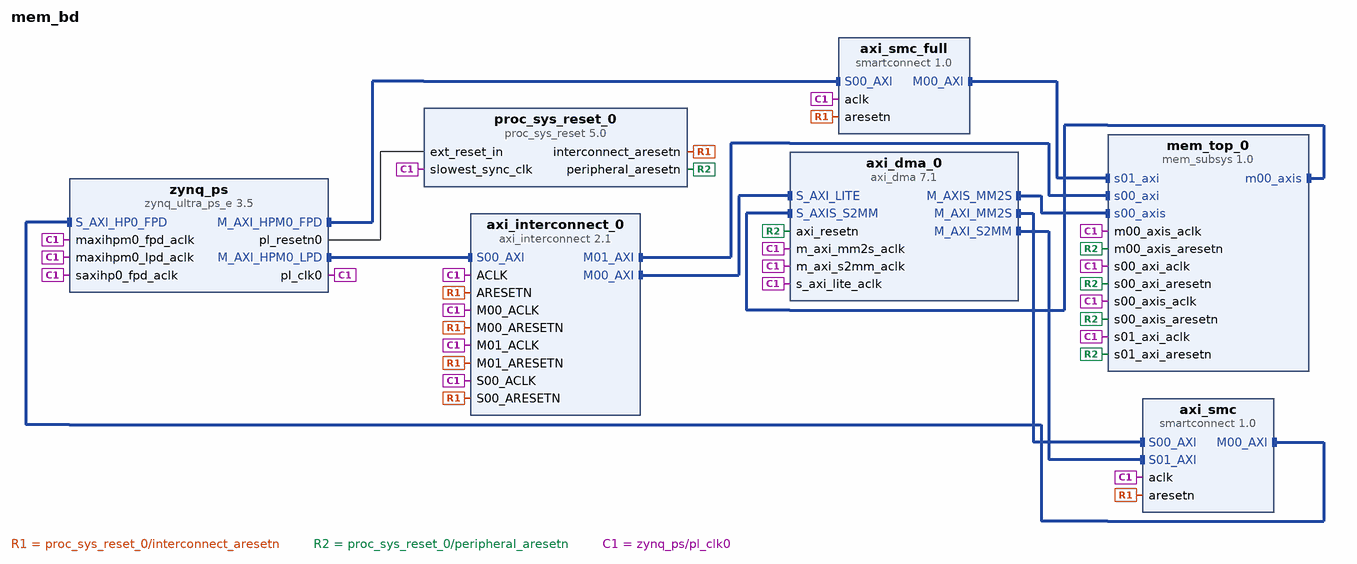
[diagram p0: block diagram of the top level]
# Vivado block design mem_bd, xczu3eg-sbva484-1-i, Vivado 2023.2
create_bd_design mem_bd

create_bd_cell -type ip -vlnv xilinx.com:ip:zynq_ultra_ps_e:3.5 zynq_ps
set_property -dict [list \
  CONFIG.PSU__CRL_APB__PL0_REF_CTRL__FREQMHZ 50 \
  CONFIG.PSU__DDR_HIGH_ADDRESS_GUI_ENABLE 0 \
  CONFIG.PSU__FPGA_PL0_ENABLE 1 \
  CONFIG.PSU__MAXIGP0__DATA_WIDTH 128 \
  CONFIG.PSU__USE__M_AXI_GP0 1 \
  CONFIG.PSU__USE__M_AXI_GP1 0 \
  CONFIG.PSU__USE__M_AXI_GP2 1 \
  CONFIG.PSU__USE__S_AXI_GP2 1 \
] [get_bd_cells zynq_ps]
# 34 more settings of zynq_ps are not shown: defaults, MIO pin electricals, DDR timing, and values the tool derives
create_bd_cell -type ip -vlnv xilinx.com:ip:proc_sys_reset:5.0 proc_sys_reset_0
create_bd_cell -type ip -vlnv xilinx.com:ip:axi_dma:7.1 axi_dma_0
set_property -dict [list \
  CONFIG.c_include_mm2s 1 \
  CONFIG.c_include_s2mm 1 \
  CONFIG.c_include_sg 0 \
  CONFIG.c_m_axi_mm2s_data_width 256 \
  CONFIG.c_m_axi_s2mm_data_width 256 \
  CONFIG.c_m_axis_mm2s_tdata_width 256 \
  CONFIG.c_mm2s_burst_size 16 \
  CONFIG.c_s2mm_burst_size 16 \
  CONFIG.c_s_axis_s2mm_tdata_width 256 \
] [get_bd_cells axi_dma_0]
create_bd_cell -type ip -vlnv user.org:user:mem_subsys:1.0 mem_top_0
create_bd_cell -type ip -vlnv xilinx.com:ip:axi_interconnect:2.1 axi_interconnect_0
set_property -dict {CONFIG.NUM_MI 2 CONFIG.NUM_SI 1} [get_bd_cells axi_interconnect_0]
create_bd_cell -type ip -vlnv xilinx.com:ip:smartconnect:1.0 axi_smc
set_property -dict {CONFIG.NUM_MI 1 CONFIG.NUM_SI 2} [get_bd_cells axi_smc]
create_bd_cell -type ip -vlnv xilinx.com:ip:smartconnect:1.0 axi_smc_full
set_property -dict {CONFIG.NUM_MI 1 CONFIG.NUM_SI 1} [get_bd_cells axi_smc_full]

# ---- connections ----

connect_bd_intf_net [get_bd_intf_pins axi_dma_0/M_AXIS_MM2S] [get_bd_intf_pins mem_top_0/s00_axis]
connect_bd_intf_net [get_bd_intf_pins axi_dma_0/M_AXI_MM2S] [get_bd_intf_pins axi_smc/S00_AXI]
connect_bd_intf_net [get_bd_intf_pins axi_dma_0/M_AXI_S2MM] [get_bd_intf_pins axi_smc/S01_AXI]
connect_bd_intf_net [get_bd_intf_pins axi_interconnect_0/M00_AXI] [get_bd_intf_pins axi_dma_0/S_AXI_LITE]
connect_bd_intf_net [get_bd_intf_pins axi_interconnect_0/M01_AXI] [get_bd_intf_pins mem_top_0/s00_axi]
connect_bd_intf_net [get_bd_intf_pins axi_smc/M00_AXI] [get_bd_intf_pins zynq_ps/S_AXI_HP0_FPD]
connect_bd_intf_net [get_bd_intf_pins axi_smc_full/M00_AXI] [get_bd_intf_pins mem_top_0/s01_axi]
connect_bd_intf_net [get_bd_intf_pins mem_top_0/m00_axis] [get_bd_intf_pins axi_dma_0/S_AXIS_S2MM]
connect_bd_intf_net [get_bd_intf_pins zynq_ps/M_AXI_HPM0_FPD] [get_bd_intf_pins axi_smc_full/S00_AXI]
connect_bd_intf_net [get_bd_intf_pins zynq_ps/M_AXI_HPM0_LPD] [get_bd_intf_pins axi_interconnect_0/S00_AXI]
connect_bd_net [get_bd_pins proc_sys_reset_0/interconnect_aresetn] \
  [get_bd_pins axi_interconnect_0/ARESETN] [get_bd_pins axi_interconnect_0/S00_ARESETN] \
  [get_bd_pins axi_interconnect_0/M00_ARESETN] [get_bd_pins axi_interconnect_0/M01_ARESETN] [get_bd_pins axi_smc/aresetn] \
  [get_bd_pins axi_smc_full/aresetn]
connect_bd_net [get_bd_pins proc_sys_reset_0/peripheral_aresetn] \
  [get_bd_pins axi_dma_0/axi_resetn] [get_bd_pins mem_top_0/s00_axi_aresetn] [get_bd_pins mem_top_0/s00_axis_aresetn] \
  [get_bd_pins mem_top_0/m00_axis_aresetn] [get_bd_pins mem_top_0/s01_axi_aresetn]
connect_bd_net [get_bd_pins zynq_ps/pl_clk0] \
  [get_bd_pins proc_sys_reset_0/slowest_sync_clk] [get_bd_pins axi_dma_0/s_axi_lite_aclk] \
  [get_bd_pins axi_dma_0/m_axi_mm2s_aclk] [get_bd_pins axi_dma_0/m_axi_s2mm_aclk] [get_bd_pins axi_interconnect_0/ACLK] \
  [get_bd_pins axi_interconnect_0/S00_ACLK] [get_bd_pins axi_interconnect_0/M00_ACLK] \
  [get_bd_pins axi_interconnect_0/M01_ACLK] [get_bd_pins axi_smc/aclk] [get_bd_pins axi_smc_full/aclk] \
  [get_bd_pins zynq_ps/maxihpm0_lpd_aclk] [get_bd_pins zynq_ps/maxihpm0_fpd_aclk] [get_bd_pins zynq_ps/saxihp0_fpd_aclk] \
  [get_bd_pins mem_top_0/s00_axi_aclk] [get_bd_pins mem_top_0/s00_axis_aclk] [get_bd_pins mem_top_0/m00_axis_aclk] \
  [get_bd_pins mem_top_0/s01_axi_aclk]
connect_bd_net [get_bd_pins zynq_ps/pl_resetn0] [get_bd_pins proc_sys_reset_0/ext_reset_in]

# ---- address map ----
assign_bd_address -offset 0x00000000 -range 2G -target_address_space [get_bd_addr_spaces axi_dma_0/Data_MM2S] [get_bd_addr_segs zynq_ps/SAXIGP2/HP0_DDR_LOW]
assign_bd_address -offset 0x00000000 -range 2G -target_address_space [get_bd_addr_spaces axi_dma_0/Data_S2MM] [get_bd_addr_segs zynq_ps/SAXIGP2/HP0_DDR_LOW]
assign_bd_address -offset 0x0080000000 -range 64K -target_address_space [get_bd_addr_spaces zynq_ps/Data] [get_bd_addr_segs axi_dma_0/S_AXI_LITE/Reg]
assign_bd_address -offset 0x0080010000 -range 4K -target_address_space [get_bd_addr_spaces zynq_ps/Data] [get_bd_addr_segs mem_top_0/s00_axi/reg0]
assign_bd_address -offset 0x00A0000000 -range 256K -target_address_space [get_bd_addr_spaces zynq_ps/Data] [get_bd_addr_segs mem_top_0/s01_axi/reg0]

validate_bd_design
save_bd_design
